# EAGLE design OSO-ALMO-A1-01 (EAGLE 9.6.2)
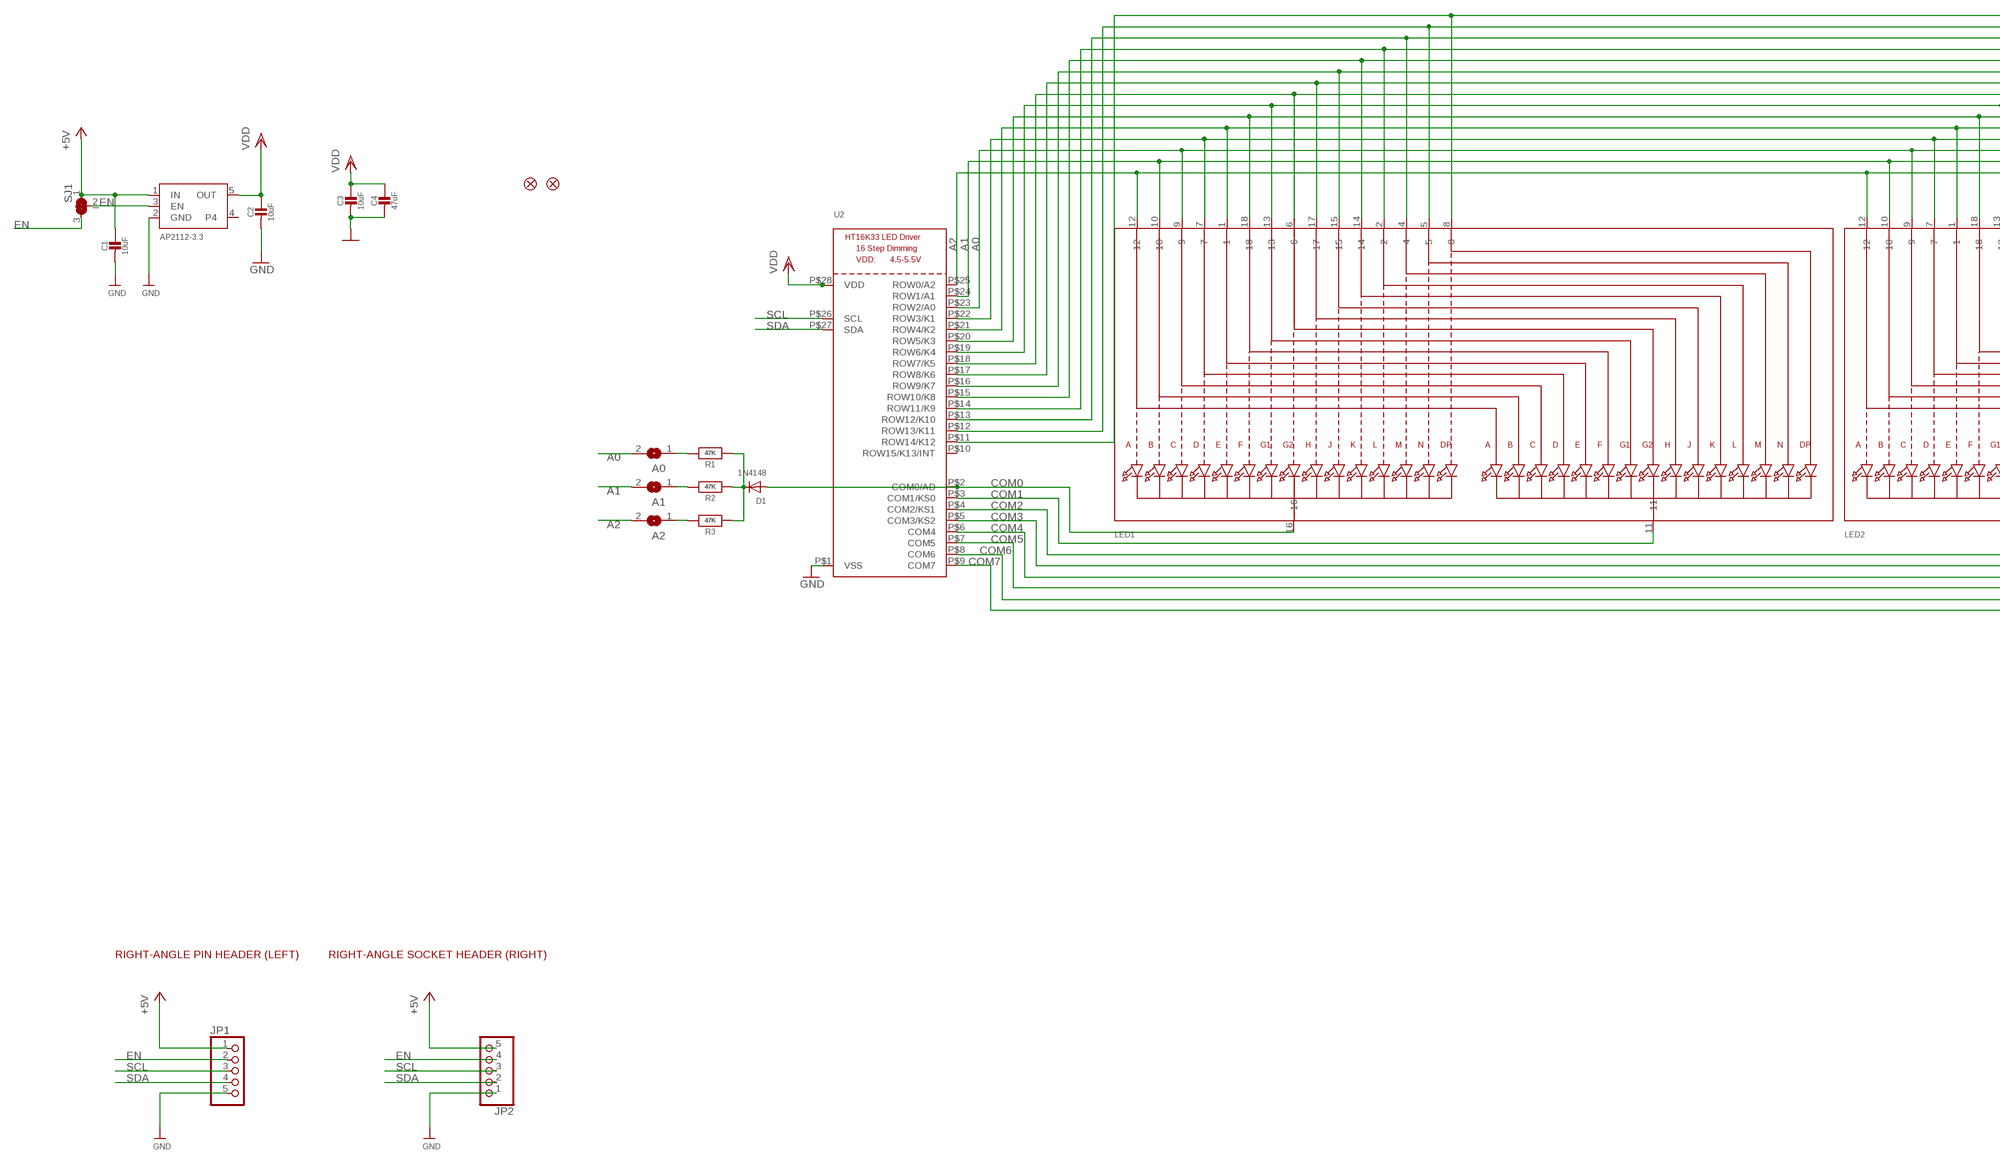
[diagram p0: schematic, sheet 1, part 1 of 2]
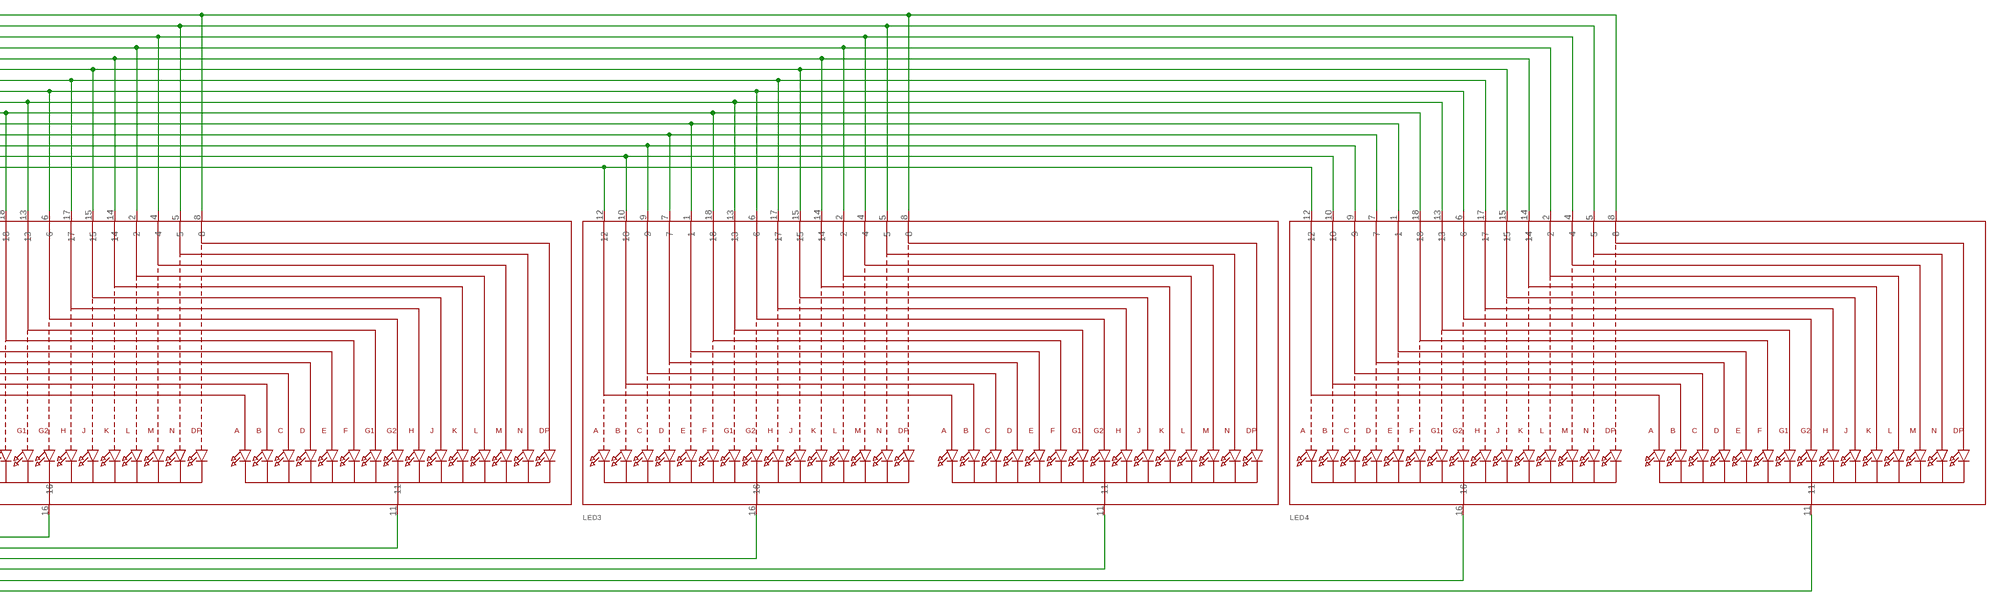
[diagram p1: schematic, sheet 1, part 2 of 2]

## Parts
A0  SOLDERJUMPERREFLOW_NOPASTE  [SOLDERJUMPER_REFLOW_NOPASTE]
A1  SOLDERJUMPERREFLOW_NOPASTE  [SOLDERJUMPER_REFLOW_NOPASTE]
A2  SOLDERJUMPERREFLOW_NOPASTE  [SOLDERJUMPER_REFLOW_NOPASTE]
C1  10uF  CAP_CERAMIC0805-NOOUTLINE  [0805-NO]
C2  10uF  CAP_CERAMIC0805-NOOUTLINE  [0805-NO]
C3  10uF  CAP_CERAMIC0805-NOOUTLINE  [0805-NO]
C4  47uF  CAP_CERAMIC0805-NOOUTLINE  [0805-NO]
D1  1N4148  DIODE_SOD-123FL  [SOD-123FL]
JP1  PINHD-1X5/90  [1X05/90]
JP2  PINHD-1X5/90  [1X05/90]
LED1  DISP_SEGMENT_STARBURST_DUAL_COMMONCATHODE  [SEGMENT_STARTBUST_DUAL_KWA-541CBB]
LED2  DISP_SEGMENT_STARBURST_DUAL_COMMONCATHODE  [SEGMENT_STARTBUST_DUAL_KWA-541CBB]
LED3  DISP_SEGMENT_STARBURST_DUAL_COMMONCATHODE  [SEGMENT_STARTBUST_DUAL_KWA-541CBB]
LED4  DISP_SEGMENT_STARBURST_DUAL_COMMONCATHODE  [SEGMENT_STARTBUST_DUAL_KWA-541CBB]
R1  47K  RESISTOR0805_NOOUTLINE  [0805-NO]
R2  47K  RESISTOR0805_NOOUTLINE  [0805-NO]
R3  47K  RESISTOR0805_NOOUTLINE  [0805-NO]
SJ1  SOLDERJUMPER_2WAY  [SOLDERJUMPER_2WAY_OPEN_NOPASTE]
U1  AP2112-3.3  VREG_SOT23-5  [SOT23-5]
U2  HT16K33_SOP28_SKINNY  [SOP28_300MIL_SKINNY]
U$1  FIDUCIAL""  [FIDUCIAL_1MM]
U$2  FIDUCIAL""  [FIDUCIAL_1MM]

## Nets
+5V [power]: C1.1 JP1.1 JP2.5 SJ1.1 U1.1(IN)
_EN: SJ1.2 U1.3(EN)
A0: A0.2 LED1.9 LED2.9 LED3.9 LED4.9 U2.P$23(ROW2/A0)
A1: A1.2 LED1.10 LED2.10 LED3.10 LED4.10 U2.P$24(ROW1/A1)
A2: A2.2 LED1.12 LED2.12 LED3.12 LED4.12 U2.P$25(ROW0/A2)
COM0: D1.A LED1.16 U2.P$2(COM0/AD)
COM1: LED1.11 U2.P$3(COM1/KS0)
COM2: LED2.16 U2.P$4(COM2/KS1)
COM3: LED2.11 U2.P$5(COM3/KS2)
COM4: LED3.16 U2.P$6(COM4)
COM5: LED3.11 U2.P$7(COM5)
COM6: LED4.16 U2.P$8(COM6)
COM7: LED4.11 U2.P$9(COM7)
EN: JP1.2 JP2.4 SJ1.3
GND: C1.2 C2.2 C3.2 C4.2 JP1.5 JP2.1 U1.2(GND) U2.P$1(VSS)
N$1: D1.C R1.1 R2.1 R3.1
N$4: LED1.17 LED2.17 LED3.17 LED4.17 U2.P$17(ROW8/K6)
N$5: LED1.15 LED2.15 LED3.15 LED4.15 U2.P$16(ROW9/K7)
N$6: LED1.14 LED2.14 LED3.14 LED4.14 U2.P$15(ROW10/K8)
N$7: A2.1 R3.2
N$8: LED1.2 LED2.2 LED3.2 LED4.2 U2.P$14(ROW11/K9)
N$9: LED1.4 LED2.4 LED3.4 LED4.4 U2.P$13(ROW12/K10)
N$10: LED1.7 LED2.7 LED3.7 LED4.7 U2.P$22(ROW3/K1)
N$11: LED1.1 LED2.1 LED3.1 LED4.1 U2.P$21(ROW4/K2)
N$12: LED1.18 LED2.18 LED3.18 LED4.18 U2.P$20(ROW5/K3)
N$13: LED1.13 LED2.13 LED3.13 LED4.13 U2.P$19(ROW6/K4)
N$14: LED1.5 LED2.5 LED3.5 LED4.5 U2.P$12(ROW13/K11)
N$15: LED1.8 LED2.8 LED3.8 LED4.8 U2.P$11(ROW14/K12)
N$16: LED1.6 LED2.6 LED3.6 LED4.6 U2.P$18(ROW7/K5)
N$19: A1.1 R2.2
N$20: A0.1 R1.2
SCL: JP1.3 JP2.3 U2.P$26(SCL)
SDA: JP1.4 JP2.2 U2.P$27(SDA)
VDD [power]: C2.1 C3.1 C4.1 U1.5(OUT) U2.P$28(VDD)
Unconnected: U1.4 U2.P$10(ROW15/K13/INT)

## Notes on the sheet
- RIGHT-ANGLE PIN HEADER (LEFT) | RIGHT-ANGLE SOCKET HEADER (RIGHT)

## Library data of the parts
A0 A1 A2 = microbuilder:SOLDERJUMPER: SMD Solder JUMPER Solder the two pads together to create a connection, or remove the solder to break it. REFLOW - Use this footprint for solder paste and reflow ovens. WAVE - Use this footprint for hand-soldering (larger pads). CLOSED - Has a trace between the two pads to ensure it is closed by default. The trace needs to be cut to disable the jumper, and can be closed again by creating a solder bridge between the two pads.
C1-C4 = microbuilder:CAP_CERAMIC: Ceramic Capacitors For new designs, use the packages preceded by an '_' character since they are more reliable: The following footprints should be used on most boards: _0402 - Standard footprint for regular board layouts _0603 - Standard footprint for regular board layouts _0805 - Standard footprint for regular board layouts _1206 - Standard footprint for regular board layouts For extremely tight-pitch boards where space is at a premium, the following 'micro-pitch' footprints can be used (smaller pads, no silkscreen outline, etc.): _0402MP - Micro-pitch footprint for very dense/compact boards _0603MP - Micro-pitch footprint for very dense/compact boards _0805MP - Micro-pitch footprint for very dense/compact boards _1206MP - Micro-pitch footprint for very dense/compact boards
D1 = adafruit:DIODE: Diode SMADIODE - SMA Surface Mount Package 20V 1A Schottky Diode Digikey: 641-1014-6-ND DO-1N4148 - Through Hole Small Current Diode SOD-123 20V 1 A (.5mV Vf) Schottky Diode - Digikey: MBRX120TPMSCT-ND SOD-323 10V 570mA (.38mV Vf, 3ns) Schottky Diode - Digikey: ZLLS410CT-ND SOD-523 30V 30mA Schottky Diode (RB751S-40TE61) - Digikey: RB751S-40TE61CT-ND SOT23-R/W - SOT23 Package (R = Solder Paste/Reflow Ovens, W = Hand-Soldering) BAT54Film 40V 300mA - Digikey: 497-7162-1-ND
JP1 JP2 = pinhead:PINHD-1X5: PIN HEADER
LED1-LED4 = microbuilder:DISP_SEGMENT_STARBURST_DUAL_COMMONCATHODE: 2 x Starburst Segment Displays - Common Cathode Luckylight KWA-541CBB
R1-R3 = microbuilder:RESISTOR: Resistors For new designs, use the packages preceded by an '_' character since they are more reliable: The following footprints should be used on most boards: _0402 - Standard footprint for regular board layouts _0603 - Standard footprint for regular board layouts _0805 - Standard footprint for regular board layouts _1206 - Standard footprint for regular board layouts For extremely tight-pitch boards where space is at a premium, the following 'micro-pitch' footprints can be used (smaller pads, no silkscreen outline, etc.): _0402MP - Micro-pitch footprint for very dense/compact boards _0603MP - Micro-pitch footprint for very dense/compact boards _0805MP - Micro-pitch footprint for very dense/compact boards _1206MP - Micro-pitch footprint for very dense/compact boards
SJ1 = pygamer-microbuilder:SOLDERJUMPER_2WAY: 2-Way Solder Jumper
U1 = microbuilder:VREG_SOT23-5: SOT23-5 Fixed Voltage Regulators Part Current Out V Out V In V Dropout θJA (°C/W) TJ (°C) Digikey Part No. ADP121 150mA 3.3V 3.4-5.5V 0.09V @ 150mA -- -- ADP121-AUJZ33R7CT-ND ADP121 150mA 3.0V 3.1-5.5V 0.09V @ 150mA -- -- ADP121-AUJZ30R7CT-ND ADP122 300mA 3.3V 3.4-5.5V 0.085V @ 300mA -- -- ADP122AUJZ-3.3-R7CT-ND ADP1712 300mA 3.3V 3.5-5.5V 0.17V @ 300mA -- -- ADP1712AUJZ-3.3-R7TR-ND AP7311 (Low Cost) 150mA 3.3V 3.5-6V 0.15V @ 150mA -- -- AP7311-33WG-7DICT-ND LD39015M18R 150mA 1.8V 1.9V-5.5V 0.08V @ 100mA -- -- 497-6977-1-ND LP2985A-33DBVR 150mA 3.3V 3.3-16V 0.28V @ 150mA 206 150 296-18479-1-ND MCP1824T-3302E/OT 300mA 3.3V 3.5V-6V 0.2V @ 300mA -- -- MCP1824T-3302E/OTCT-ND MIC5205-2.5YM5 TR 150mA 2.5V 2.7-16V 0.165V @ 150mA -- -- 576-1257-2-ND MIC5205-3.0YM5 TR 150mA 3.0V 3.2V-16V 0.165V @ 150mA -- -- 576-1258-2-ND MIC5205-3.3YM5 TR 150mA 3.3V 3.5V-16V 0.165V @ 150mA -- -- 576-1259-2-ND TPS780330220 150mA 3.3V+2.2V 3.6-5.5V 250mV Max -- -- 296-23332-1-ND TDA3663/N1,135 100mA 3.3V 3.5-45V 0.18V @ 50mA -- -- 568-5343-1-ND Max operating temp can be calculated using θJA, TJ (max junction temperature), and power in watts. Set the "Maximum Ambient Temperature" until it reaches TJ ("Max Junction Temperature"), which is the absolute limit for safe use of the regulator: Heat Sink Temperature Calculator <http://www.daycounter.com/Calculators/Heat-Sink-Temperature-Calculator.phtml> For example, With 12V source into a 3.3V LP2985 and a 30mA load, we are dissipating (12V-3.3V) * 0.03A = 0.261W. With a θJA of 206 °C/W, a TJ of 150°C, and 261mW we can safely use the chip without a heat sink up to 75°C (=147.1°C Junction Temperature).
U2 = microbuilder:HT16K33_SOP28
U$1 U$2 = microbuilder:FIDUCIAL: Fiducial Alignment Points Various fiducial points for machine vision alignment.; BOM: EXCLUDE

## Net classes
0 default: width 0.152 mm, drill 0.254 mm
1 power: width 0.305 mm, drill 0.305 mm
2 gnd: width 0.305 mm

## Board
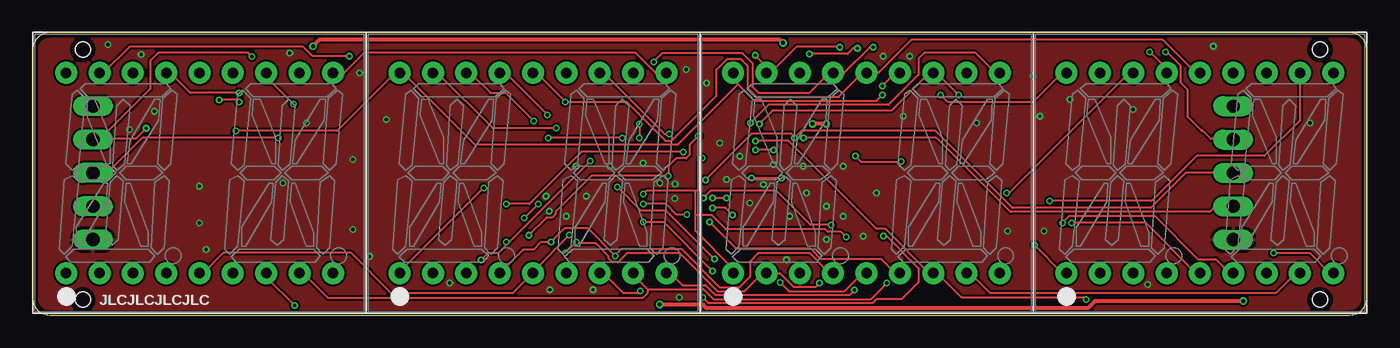
[diagram p2: board, top side]
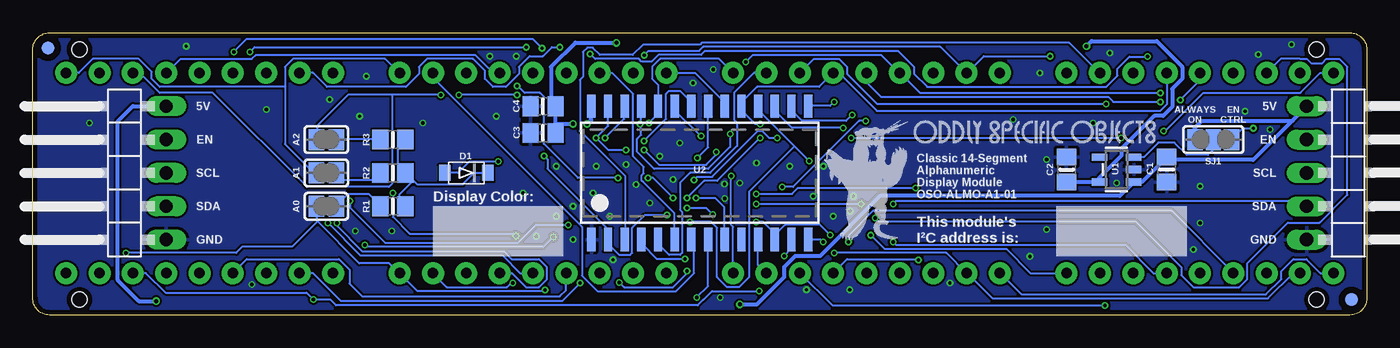
[diagram p3: board, bottom side, seen from below]

Size 101.6 x 21.49 mm. Coordinates in mm from the lower left corner, seen from the top.
Outline: 100.33,21.49 1.27,21.49 arc90 0,20.22 0,1.27 arc90 1.27,0 100.33,0 arc90 101.6,1.27 101.6,20.22 arc90 100.33,21.49
Copper layers (1*16): Top 0.035559375mm / dielectric 1.6mm / Bottom 0.035559375mm
Design rules "oshpark-2layer *": minimum track width 6mil, minimum drill 10mil, track to track 6mil, track to pad 6mil, pad to pad 6mil, via to via 6mil, smd to smd 6mil, copper to edge 15mil, drill to drill 6mil, minimum pad ring 5mil, minimum via ring 5mil, stop-mask expansion 2.5mil, vias tented up to drill 12mil, thermal gap 10mil
Holes 1.15 mm at 3.81,1.17 98.04,1.17 98.04,20.22 3.81,20.22
bRestrict: 6 lines

### Footprints (pad centres in the part's own frame; a part is rotated, then mirrored left to right if it is on the bottom)
SOLDERJUMPER_REFLOW_NOPASTE = smd 1.168 x 1.6: 1 -0.762,0; 2 0.762,0
0805-NO = smd 1.24 x 1.5: 1 -0.95,0; 2 0.95,0
SOD-123FL = smd 0.91 x 1.22: A 1.637,0; C -1.637,0
1X05/90 = drill 1.016 long: 1 -5.08,-3.81; 2 -2.54,-3.81; 3 0,-3.81; 4 2.54,-3.81; 5 5.08,-3.81
SEGMENT_STARTBUST_DUAL_KWA-541CBB = drill 0.8 pad 1.676: 1 -10.16,-7.62; 2 -7.62,-7.62; 3 -5.08,-7.62; 4 -2.54,-7.62; 5 0,-7.62; 6 2.54,-7.62; 7 5.08,-7.62; 8 7.62,-7.62; 9 10.16,-7.62; 10 10.16,7.62; 11 7.62,7.62; 12 5.08,7.62; 13 2.54,7.62; 14 0,7.62; 15 -2.54,7.62; 16 -5.08,7.62; 17 -7.62,7.62; 18 -10.16,7.62
SOLDERJUMPER_2WAY_OPEN_NOPASTE = smd 1.168 x 1.6: 1 -1.397,0; 2 0,0; 3 1.397,0
SOT23-5 = smd 0.55 x 1.2: 1 -0.95,-1.3; 2 0,-1.3; 3 0.95,-1.3; 4 0.95,1.3; 5 -0.95,1.3
SOP28_300MIL_SKINNY = smd 0.635 x 1.778: P$1 -8.255,-5.08; P$2 -6.985,-5.08; P$3 -5.715,-5.08; P$4 -4.445,-5.08; P$5 -3.175,-5.08; P$6 -1.905,-5.08; P$7 -0.635,-5.08; P$8 0.635,-5.08; P$9 1.905,-5.08; P$10 3.175,-5.08; P$11 4.445,-5.08; P$12 5.715,-5.08; P$13 6.985,-5.08; P$14 8.255,-5.08; P$15 8.255,5.08; P$16 6.985,5.08; P$17 5.715,5.08; P$18 4.445,5.08; P$19 3.175,5.08; P$20 1.905,5.08; P$21 0.635,5.08; P$22 -0.635,5.08; P$23 -1.905,5.08; P$24 -3.175,5.08; P$25 -4.445,5.08; P$26 -5.715,5.08; P$27 -6.985,5.08; P$28 -8.255,5.08
FIDUCIAL_1MM = smd 1 x 1: 1 0,0

### Placement (x,y rotation side)
A0  79.25,8.28 180 bottom
A1  79.25,10.82 180 bottom
A2  79.25,13.36 180 bottom
C1  15.24,11.07 270 bottom
C2  22.86,11.07 90 bottom
C3  62.74,13.87 180 bottom
C4  62.74,15.9 180 bottom
D1  68.58,10.82 180 bottom
JP1  0.76,10.82 270 bottom
JP2  95.25,10.82 90 bottom
LED1  12.7,10.82 0 top
LED2  38.1,10.82 0 top
LED3  63.5,10.82 0 top
LED4  88.9,10.82 0 top
R1  74.17,8.28 180 bottom
R2  74.17,10.82 180 bottom
R3  74.17,13.36 180 bottom
SJ1  11.68,13.36 0 bottom
U1  19.05,11.07 90 bottom
U2  50.8,10.82 0 bottom
U$1  1.14,1.17 0 bottom
U$2  100.46,20.35 0 bottom
U$3  [OSO_WORDMARK_ONELINE_725MIL_1000DPI]  34.54,12.98 0 bottom
U$6  [OSO_BEAR_250X360MIL_1000DPI]  38.1,10.31 0 bottom

### Tracks (layer width: path | path; a pad name or v marks a point on that pad's centre or on a via)
+5V  (via drill 0.3)
  Top 0.305: v92.2,1.07 80.9,1.07 80.37,0.53 51.3,0.53 51.05,0.79 47.78,0.79 v47.75,0.81
  Bottom 0.305: 5.66,14.78 4.6,15.85 JP1.1 | SJ1.1 13.08,14.25 12.55,14.78 5.66,14.78 | 5.66,14.78 8.64,11.81 14.57,11.81 C1.1 17.14,10.12 U1.1 18.81,9.07 37.06,9.07 41.63,4.5 43.54,4.5 44.37,3.66 44.37,2.9 46.46,0.81 v47.75,0.81 | v92.2,1.07 93.52,1.07 95.12,2.67 95.12,14.76 93.98,15.9 JP2.5
_EN
  Bottom 0.152: U1.3 16.99,12.02 15.88,13.13 14.65,13.13 13.71,12.19 12.09,12.19 11.68,12.6 SJ1.2 10.16,13.36
A0  (via drill 0.25)
  Top 0.152: LED4.9 98.78,3.2 97.26,4.72 v94.51,4.72 | v62.59,1.91 62.2,1.52 51.99,1.52 51.23,2.29 49.48,2.29 48.56,3.2 LED2.9 | v37.77,6.07 39.12,7.42 39.55,7.42 39.83,7.7 39.83,7.87 42.55,10.59 v48.41,10.59 48.41,11.35 49,11.94 49.75,11.94 50.04,12.22 50.04,12.98 v50.7,13.64
  Bottom 0.152: 79.92,7.12 76.73,3.94 74.45,3.94 73.71,3.2 LED3.9 72.29,1.83 62.76,1.83 62.69,1.91 v62.59,1.91 | 79.92,7.12 79.96,7.16 79.96,8.23 A0.2 | v94.51,4.72 86.11,4.72 85.6,5.23 81.81,5.23 79.92,7.12 | v50.7,13.64 50.75,13.64 52.68,15.57 52.68,15.85 U2.P$23 | v48.41,10.59 48.41,6.86 48.26,6.71 LED2.9 | LED1.9 25.63,3.2 27.46,5.03 36.73,5.03 v37.77,6.07
A1  (via drill 0.25)
  Top 0.152: LED1.10 23.7,18.44 25.22,19.96 45.92,19.96 47.45,18.44 LED2.10 | v54.66,14.63 56.03,16 65.18,16 67.46,18.29 67.46,19.51 67.92,19.96 71.81,19.96 73.33,18.44 LED3.10
  Bottom 0.152: LED2.10 49.33,19.51 53.82,19.51 54.43,18.9 54.43,17.98 53.97,17.53 U2.P$24 53.97,15.32 v54.66,14.63 | A1.2 80.21,10.82 82.4,13 82.4,17.37 | 82.4,17.37 82.4,18.9 81.79,19.51 74.78,19.51 73.71,18.44 LED3.10 | LED4.10 98.09,18.44 97.03,19.51 93.52,19.51 92.53,18.52 92.53,17.98 91.92,17.37 82.4,17.37
A2  (via drill 0.25)
  Top 0.152: v70.51,16.76 68.83,18.44 LED3.12 68.3,18.44 65.46,15.6 56.39,15.6 v55.35,14.55 | v48.49,13.79 48.11,13.79 43.46,18.44 LED2.12 | LED1.12 17.78,18.14 v19.84,16.08
  Bottom 0.152: v70.51,16.76 74.24,16.76 | 74.24,16.76 77.6,16.76 79.96,14.4 79.96,13.41 A2.2 | LED4.12 93.45,18.44 91.92,16.92 87.88,16.92 80.72,9.75 74.47,9.75 74.24,9.98 74.24,16.76 | 55.27,14.55 55.27,13.72 55.58,13.41 55.58,12.42 54.28,11.13 50.16,11.13 48.49,12.8 v48.49,13.79 | 55.27,14.55 55.27,15.85 U2.P$25 | v19.84,16.08 37.29,16.08 39.57,18.36 39.57,18.9 40.18,19.51 42.09,19.51 43.16,18.44 LED2.12 | 55.27,14.55 v55.35,14.55
COM0  (via drill 0.25)
  Top 0.152: v62.66,12.12 63.09,11.68 v66.14,11.68 | v38.51,8.46 v37.44,7.39 | v46.51,8.46 48.23,8.46 49.05,7.65 v49.81,7.65 | v51.77,8.15 52.76,8.15 v53.29,7.62
  Bottom 0.152: D1.A 69.22,10.82 68.35,11.68 v66.14,11.68 | v62.66,12.12 62.41,11.86 62.41,11.15 57.78,6.53 U2.P$2 57.78,5.41 56.95,4.57 56.11,4.57 55.96,4.72 55.96,6.63 54.97,7.62 v53.29,7.62 | LED1.16 6.55,19.51 5.08,19.51 4.56,19.51 4.24,19.19 3.38,19.19 3.06,19.51 2.08,19.51 1.47,18.9 1.47,9.14 3.58,7.04 5.99,7.04 9.09,3.94 9.09,2.74 9.7,2.13 13.21,2.13 14.12,3.05 14.12,3.66 17.6,7.14 37.19,7.14 v37.44,7.39 | v46.51,8.46 v38.51,8.46 | v51.77,8.15 50.32,8.15 v49.81,7.65
COM1
  Bottom 0.152: U2.P$3 56.49,5.79 56.49,10.59 59.92,14.02 59.92,17.91 59.69,18.14 59.69,20.04 59.36,20.37 58.96,20.37 58.4,19.81 55.91,19.81 55.12,20.6 50.8,20.6 50.67,20.73 22.66,20.73 20.37,18.44 LED1.11
COM2  (via drill 0.25)
  Top 0.152: v51.92,4.27 48.21,7.98 46.3,7.98 v44.53,9.75 | v38.15,14.78 36.02,16.92 34.85,16.92 33.32,18.44 LED2.16
  Bottom 0.152: v51.92,4.27 54.05,4.27 55.19,5.41 55.19,5.72 U2.P$4 | v44.53,9.75 43.69,9.75 38.66,14.78 v38.15,14.78
COM3
  Bottom 0.152: U2.P$5 53.97,5.41 53.14,4.57 52.3,4.57 52.15,4.72 52.15,7.85 52.3,8 52.3,10.06 51.54,10.82 50.01,10.82 47.95,12.88 47.95,14.63 48.18,14.86 48.18,16.92 46.66,18.44 LED2.11
COM4
  Bottom 0.152: LED3.16 57.48,18.44 55.88,16.84 55.88,12.09 55.08,11.29 55.08,10.78 55.22,10.64 55.22,10.24 55.08,10.1 52.76,7.77 52.76,5.79 U2.P$6
COM5
  Bottom 0.152: LED3.11 71.12,18.06 59.77,6.71 59.77,3 58.6,1.83 52.6,1.83 51.23,3.2 51.23,5.64 U2.P$7
COM6  (via drill 0.25)
  Top 0.152: v51.03,1.35 51.46,0.91 63.96,0.91 64.26,1.22 66.17,1.22 67.46,2.51 67.46,3.58 65.02,6.02 v64.8,6.02 | v74.17,9.3 74.4,9.3 83.54,18.44 LED4.16
  Bottom 0.152: U2.P$8 50.16,2.21 v51.03,1.35 | v64.8,6.02 64.97,6.2 72.9,6.2 74.17,7.47 v74.17,9.3
COM7  (via drill 0.25)
  Top 0.152: v51.08,8.92 51.61,9.45 56.64,9.45 59.23,6.86 v60.81,6.86 | v77.44,8.69 85.22,8.69 88.65,12.12 93.8,12.12 96.5,14.81 96.5,18.44 LED4.11
  Bottom 0.152: v51.08,8.92 49.63,8.92 48.95,8.23 48.95,5.79 U2.P$9 | v60.81,6.86 63.27,6.86 64.64,5.49 74.75,5.49 75.09,5.83 77.44,8.18 v77.44,8.69
EN  (via drill 0.25)
  Top 0.152: 5.13,13.41 4.6,13.41 JP1.2 | 5.13,13.41 8.94,17.22 8.94,19.35 9.55,19.96 16.41,19.96 v16.69,19.69 | v59.16,19.89 62.05,19.89 62.48,20.32 v62.81,20.32 | v86.28,20.04 86.36,20.04 87.43,18.97 87.43,17.68 87.96,17.15 87.96,15.09 89.03,14.02 89.1,14.02 89.71,13.41 90.17,13.41 JP2.4 | v8.64,14.22 7.82,13.41 5.13,13.41
  Bottom 0.152: v16.69,19.69 18.06,19.69 18.97,18.77 18.97,18.24 19.84,17.37 33.48,17.37 34.47,18.36 34.47,18.9 35.69,20.12 50.39,20.12 50.7,19.81 53.95,19.81 54.46,19.3 55.23,19.3 55.44,19.51 58.78,19.51 v59.16,19.89 | v62.81,20.32 63.52,21.03 85.29,21.03 v86.28,20.04 | SJ1.3 9.42,14.22 v8.64,14.22
GND  (via drill 0.25)
  other vias: 12.7,7.01 12.7,9.8 19.05,10.06 24.38,11.84 40.64,7.52 42.16,9.04 47.75,10.06 48.92,9.98 39.09,9.04 46.48,11.58 43.94,11.33 41.38,11.33 24.38,6.5 25.65,4.47 31.75,2.44 39.37,1.93 42.67,1.93 49.25,1.35 54.61,8.53 52.32,13.11 58.93,9.3 58.67,11.33 61.72,7.52 61.72,11.33 64.26,9.3 57.4,4.22 52.83,10.31 63.25,5.99 57.66,7.52 97.28,14.63 83.82,15.65 78.99,16.41 76.71,15.14 71.88,14.63 76.2,18.19 64.77,19.71 84.91,2.34 77.04,6.4 74.24,6.4 53.85,12.09 66.29,15.14 26.92,14.88 20.83,14.63 9.27,15.52 48.89,8.86 55.65,9.93 56.41,11.46 13.21,4.98 39.34,7.9 49.78,18.69 51.31,17.68 7.37,14.12 19.56,19.96 60.45,5.74 60.45,8.28 66.8,19.71 24.89,18.44 8.25,19.84 5.71,20.6 89.92,20.47
  pour Bottom: 101.6,22.25 101.6,-0.61 0,-0.61 0,22.25
  pour Top: 101.6,22.25 101.6,-0.61 0,-0.61 0,22.25
N$1
  Bottom 0.152: D1.C 68,10.82 68.86,9.96 72.31,9.96 73.18,10.82 R2.1 | R1.1 73.69,8.75 73.69,9.17 72.64,10.21 R2.1 | R3.1 73.76,12.97 73.76,10.82 R2.1
N$4  (via drill 0.25)
  Top 0.152: v39.88,14.25 35,14.25 30.81,18.44 LED2.17 | LED1.17 5.36,18.44 7.37,20.45 20.57,20.45 21.31,19.71 v24.1,19.71 | v55.02,19.79 55.88,18.92 LED3.17 55.88,18.82 56.57,18.82 58.17,20.42 61.44,20.42 v61.47,20.4
  Bottom 0.152: v39.88,14.25 43.76,14.25 45.06,15.54 45.06,15.85 U2.P$17 | v24.1,19.71 29.16,19.71 30.43,18.44 LED2.17 30.5,18.44 32.49,20.42 50.55,20.42 50.85,20.12 54.69,20.12 v55.02,19.79 | LED4.17 80.26,18.44 79.2,17.37 73.18,17.37 72.19,18.36 72.19,18.9 71.58,19.51 68.07,19.51 67.16,18.59 67.16,17.98 66.55,17.37 65.56,17.37 64.57,18.36 64.57,18.9 63.75,19.71 62.74,19.71 62.05,20.4 v61.47,20.4
N$5  (via drill 0.25)
  Top 0.152: v64.01,20.4 63.75,20.4 61.8,18.44 LED3.15 60.68,18.44 59.16,16.92 55.27,16.92 54.81,17.37 54.81,19.18 54.03,19.96 47.98,19.96 v47.3,19.28 | v85.06,20.04 86.36,18.75 LED4.15 | v39.19,15.24 35.99,18.44 LED2.15 | LED1.15 10.46,18.44 11.99,16.92 v15.72,16.92
  Bottom 0.152: v64.01,20.4 84.71,20.4 v85.06,20.04 | v39.19,15.24 39.65,14.78 43,14.78 43.76,15.54 43.76,15.85 U2.P$16 | v15.72,16.92 34.01,16.92 35.53,18.44 LED2.15 35.61,18.44 36.98,19.81 46.76,19.81 v47.3,19.28
N$6  (via drill 0.25)
  Top 0.152: LED4.14 88.57,18.44 86.06,20.96 66.93,20.96 64.41,18.44 LED3.14 63.2,18.44 61.37,16.61 55.12,16.61 54.43,17.3 54.43,18.97 53.9,19.51 52.9,19.51 52.07,18.68 52.07,16.69 48.64,13.26 48.18,13.26 45.21,16.23 v40.56,16.23 38.35,18.44 LED2.14 | v14.2,16.38 15.57,16.38 v15.72,16.23
  Bottom 0.152: v40.56,16.23 40.87,15.93 42.55,15.93 U2.P$15 | v14.2,16.38 12.75,17.83 12.75,18.44 LED1.14 | v15.72,16.23 19.3,16.23 19.68,16.61 36.98,16.61 38.1,17.73 LED2.14
N$7
  Bottom 0.152: R3.2 75.16,13.41 78.44,13.41 A2.1
N$8  (via drill 0.25)
  Top 0.152: v40.56,4.72 v41.4,5.56 41.4,5.49 42.85,5.49 43.84,4.5 43.84,4.34 44.17,4.01 44.57,4.01 44.74,4.18 45.29,4.72 49.25,4.72 52.15,1.83 54.2,1.83 55.58,3.2 LED3.2 56.9,3.2 57.96,2.13 59.61,2.13 v59.92,2.44
  Bottom 0.152: v41.4,5.56 41.55,5.72 42.55,5.72 U2.P$14 | v40.56,4.72 32.03,4.72 30.5,3.2 LED2.2 30.43,3.2 28.5,1.27 7.52,1.27 5.59,3.2 LED1.2 | LED4.2 80.26,3.2 78.13,1.07 61.29,1.07 v59.92,2.44
N$9  (via drill 0.25)
  Top 0.152: LED2.4 37.34,4.98 38.12,4.98 38.71,5.56 v39.47,5.56 40.54,6.63 42.24,6.63 v44.37,4.5 44.37,4.57 44.83,5.03 49.4,5.03 52.3,2.13 53.82,2.13 54.66,2.97 54.66,4.11 55.27,4.72 59.16,4.72 60.68,3.2 LED3.4
  Bottom 0.152: LED4.4 85.29,4.27 78.28,4.27 77.47,3.45 77.47,2.39 76.5,1.42 61.47,1.42 60.98,1.91 60.98,3.2 LED3.4 | v44.37,4.5 43.84,5.03 43.84,5.72 U2.P$13 | LED1.4 10.16,3.23 14.86,7.92 37.59,7.92 39.47,6.05 v39.47,5.56
N$10  (via drill 0.25)
  Top 0.152: LED1.7 17.78,2.9 v19.94,0.74 | v55.04,13.26 57.56,13.26 64.26,6.55 64.95,6.55 68.3,3.2 LED3.7 68.91,3.2 70.74,1.37 80.06,1.37 v80.24,1.19 | LED2.7 43.46,3.2 44.98,1.68 46.13,1.68 v46.28,1.83
  Bottom 0.152: v19.94,0.74 40.69,0.74 43.16,3.2 LED2.7 | v55.04,13.26 53.36,14.94 53.36,16.84 53.14,17.07 52.3,17.07 51.46,16.23 51.46,15.93 U2.P$22 | LED4.7 92.99,3.2 91.49,1.7 80.75,1.7 v80.24,1.19 78.97,1.19 78.51,0.74 50.96,0.74 50.54,1.16 50.53,1.16 49.86,1.83 v46.28,1.83
N$11  (via drill 0.25)
  Top 0.152: 50.47,7.62 50.47,6.4 53.29,3.58 53.29,3.2 LED3.1 | 50.47,7.62 50.47,9.47 | v50.98,11.96 50.72,11.71 50.72,9.47 50.47,9.47 | LED4.1 78.44,3.2 v76.3,5.33 | v61.95,5.94 61.57,6.32 60.55,6.32 60.32,6.55 52.76,6.55 51.69,7.62 50.47,7.62 | v34.34,9.68 27.99,3.33 27.99,3.2 LED2.1 | 50.47,9.47 46.76,9.47 v46.51,9.22
  Bottom 0.152: LED1.1 3.53,3.2 4.6,4.27 5.59,4.27 6.5,3.35 6.5,2.74 7.67,1.57 26.29,1.57 27.91,3.2 LED2.1 | U2.P$21 50.16,12.78 v50.98,11.96 | v76.3,5.33 76.15,5.18 62.71,5.18 v61.95,5.94 | v34.34,9.68 43.31,9.68 43.76,9.22 v46.51,9.22
N$12  (via drill 0.25)
  Top 0.152: v15.47,14.02 23.19,14.02 27.23,18.06 27.53,18.06 27.91,18.44 LED2.18 28.22,18.44 33.71,12.95 49.1,12.95 53.71,17.56 | LED4.18 78.44,18.44 76.22,16.23 69.67,16.23 v69.14,16.76 | v64.72,16.76 64.26,16.31 54.97,16.31 53.71,17.56 | 53.71,17.56 53.36,17.91 53.36,18.44 LED3.18
  Bottom 0.152: LED1.18 3.53,18.44 5.05,16.92 12.45,16.92 15.34,14.02 v15.47,14.02 | LED3.18 51.16,18.44 48.95,16.23 48.95,15.93 U2.P$20 | v64.72,16.76 v69.14,16.76
N$13  (via drill 0.25)
  Top 0.152: LED3.13 65.71,18.44 v64.72,17.45 | v54.74,10.44 v57.02,10.44 | v51.77,8.92 v52.83,8.92 | v46.2,14.55 v46.2,13.49
  Bottom 0.152: LED3.13 66.55,18.44 67.92,19.81 84.61,19.81 84.91,19.51 90.32,19.51 91.39,18.44 LED4.13 | LED1.13 15.19,18.44 15.19,16.08 15.72,15.54 37.31,15.54 40.21,18.44 LED2.13 41.71,17.37 46.43,17.37 47.57,16.23 47.57,15.93 U2.P$19 47.57,15.85 47.57,15.54 46.58,14.55 v46.2,14.55 | v64.72,17.45 64.67,17.45 64.13,16.92 62.97,16.92 62.66,16.61 62.66,13.03 60.07,10.44 v57.02,10.44 | v54.74,10.44 54.36,10.44 v52.83,8.92 | v51.77,8.92 50.47,10.21 49.48,10.21 v46.2,13.49
N$14  (via drill 0.25)
  Top 0.152: v79.12,7.01 84.76,7.01 88.57,3.2 LED4.5 | v40.87,6.1 38.12,3.35 38.12,3.2 LED2.5 38.08,3.2 36.55,1.68 27.3,1.68 24.26,4.72 14.5,4.72 12.98,3.2 LED1.5 | LED3.5 63.2,3.2 61.82,1.83 57.58,1.83 v56.92,2.49 | v51.77,3.35 48.03,7.09 v46.51,7.09
  Bottom 0.152: LED3.5 64.49,3.2 65.84,4.55 76.66,4.55 v79.12,7.01 | v40.87,6.1 41.63,6.86 44.3,6.86 45.06,6.1 45.06,5.79 U2.P$12 45.06,6.17 45.97,7.09 v46.51,7.09 | v56.92,2.49 56.57,2.13 52.83,2.13 51.77,3.2 v51.77,3.35
N$15  (via drill 0.25)
  Top 0.152: LED3.8 71.42,3.2 72.95,1.68 94.67,1.68 96.19,3.2 LED4.8 | LED1.8 20.6,3.2 22.5,1.3 46.43,1.3 46.81,1.68 46.81,1.98 | 46.81,1.98 45.74,3.05 45.74,3.2 LED2.8 | 46.81,1.98 51.08,1.98 51.84,1.22 63.83,1.22 v65.05,2.44
  Bottom 0.152: U2.P$11 46.35,3.81 45.74,3.2 LED2.8 | LED3.8 71.12,3.18 70.08,2.13 65.48,2.13 65.18,2.44 v65.05,2.44
N$16  (via drill 0.25)
  Top 0.152: 36.18,5.45 35.46,4.72 34.67,4.72 v34.14,4.19 | 36.18,5.45 v42.47,11.73 | 36.18,5.45 v36.07,5.56 | LED3.6 65.71,3.2 64.64,4.27 60.05,4.27 59.28,5.03 53.59,5.03 v51.54,7.09 | LED4.6 91.16,3.2 90.09,4.27 88.72,4.27 85.45,7.54 78.97,7.54 v78.44,7.01
  Bottom 0.152: U2.P$18 46.35,15.62 43.57,12.84 | v42.47,11.73 43.57,12.84 | v34.14,4.19 34.21,4.27 39.57,4.27 LED2.6 | LED1.6 16.26,3.2 18.39,5.33 35.84,5.33 v36.07,5.56 | v51.54,7.09 49.94,7.09 49.48,6.63 49.48,2.9 48.72,2.13 47.8,2.13 47.04,2.9 47.04,9.37 43.57,12.84 | v78.44,7.01 78.44,6.78 76.5,4.85 65.71,4.85 65.13,4.27 63.04,4.27 62.43,3.66 62.43,2.74 63.04,2.13 64.03,2.13 65.1,3.2 LED3.6
N$19
  Bottom 0.152: A1.1 77.98,10.31 75.63,10.31 R2.2
N$20
  Bottom 0.152: R1.2 75.12,8.32 76.02,9.22 77.6,9.22 78.51,8.31 A0.1
SCL  (via drill 0.25)
  Top 0.152: JP2.3 87.83,10.82 85.17,8.15 74.62,8.15 68.76,14.02 58.55,14.02 v58.01,13.49 58.01,13.56 57.78,13.79 54.74,13.79 v51.23,10.29 | JP1.3 5.66,10.82 8.33,13.49 v18.69,13.49 | v44.91,13.49 v39.27,13.49
  Bottom 0.152: v58.01,13.49 56.57,14.94 56.57,15.85 U2.P$26 | v39.27,13.49 v18.69,13.49 | v44.91,13.49 45.52,13.49 46.05,14.02 46.35,14.02 49.86,10.52 51,10.52 v51.23,10.29
SDA  (via drill 0.25)
  Top 0.152: v58.7,13.49 68.83,13.49 74.47,7.85 89.64,7.85 90.07,8.28 JP2.2 | v36.07,8.46 37.82,8.46 41.78,12.42 v49.55,12.42 | v56.41,12.57 v55.04,12.57
  Bottom 0.152: U2.P$27 57.78,14.4 v58.7,13.49 57.78,12.57 v56.41,12.57 | v36.07,8.46 35.84,8.69 4.98,8.69 JP1.4 | v49.55,12.42 49.55,12.19 50.32,11.43 53.9,11.43 v55.04,12.57
VDD  (via drill 0.3)
  Top 0.305: v60.45,14.55 v59.38,14.55 | v21.34,20.47 21.82,20.96 56.92,20.96 v57.15,20.73
  Bottom 0.305: v59.38,14.55 59.08,14.86 59.08,15.85 U2.P$28 | v60.45,14.55 61.75,14.55 C3.1 61.82,13.87 61.82,15.85 C4.1 61.9,16 62.13,16.23 62.13,18.9 62.12,18.9 60.27,20.75 57.17,20.75 v57.15,20.73 | C2.1 U1.5 20.37,10.31 20.37,10.44 18.69,12.12 18.69,12.65 16.18,15.16 15.49,15.16 14.81,15.85 14.81,17.22 14.05,17.98 14.05,18.9 16,20.85 20.95,20.85 v21.34,20.47

### Text on the board
tPlace: JLCJLCJLCJLC
bPlace: 5V | 5V | EN / CTRL | ALWAYS / ON | EN | EN | SCL | Classic 14-Segment / Alphanumeric / Display Module / OSO-ALMO-A1-01 | SCL | Display Color: | SDA | SDA | This module's / I²C address is: | GND | GND